# EAGLE design RFM69_RPI_adapter (EAGLE 8.5.1)
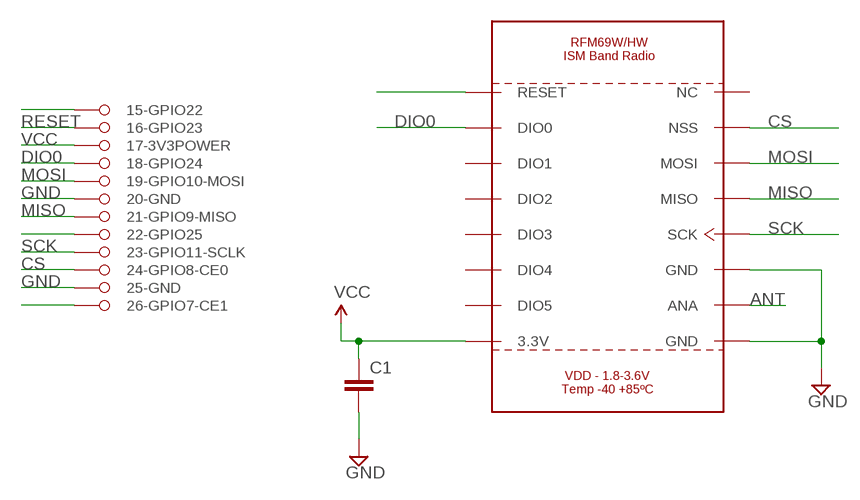
[diagram p0: schematic, sheet 1]

## Parts
C1  C-EUC1206K  [C1206K]
U$1  RFM69W/HW-  [RFM69W/HW]
U$2  RASPBPI_16-26  [RASPBP1_16-26]

## Nets
ANT: U$1.P$10(ANA)
CS: U$1.P$15(NSS) U$2.24-GPIO8-CE0
DIO0: U$1.P$2(DIO0) U$2.18-GPIO24
GND: C1.2 U$1.P$9(GND) U$1.P$11(GND) U$2.20-GND U$2.25-GND
MISO: U$1.P$13(MISO) U$2.21-GPIO9-MISO
MOSI: U$1.P$14(MOSI) U$2.19-GPIO10-MOSI
N$1: U$2.26.GPIO6-CE1(26-GPIO7-CE1)
N$5: U$2.22-GPIO25
N$12: U$2.15-GPIO22
RESET: U$1.P$1(RESET) U$2.16-GPIO23
SCK: U$1.P$12(SCK) U$2.23-GPIO11-SCKL(23-GPIO11-SCLK)
VCC: C1.1 U$1.P$8(3.3V) U$2.17-3V3POWER
Unconnected: U$1.P$3(DIO1) U$1.P$4(DIO2) U$1.P$5(DIO3) U$1.P$6(DIO4) U$1.P$7(DIO5) U$1.P$16(NC)

## Library data of the parts
C1 = rcl:C-EU: CAPACITOR, European symbol; SPICEPREFIX: C
U$1 = HopeRF:RFM69W/HW: HopeRF RFM69W / RFM69HW ISM Band Radio Modules The RFM69W/HW are transceiver modules capable of operation over a wide frequency range, including the 315, 433, 868 and 915MHz license-free ISM (Industry Scientific and Medical) frequency bands. All major RF communication parameters are programmable and most of them can be dynamically set. The RFM69W/HW offer the unique advantage of programmable narrow-band and wide- band communication modes The RFM69W/HW are optimized for low power consumption while offering high RF output power and channelized operation. Compliance ETSI and FCC regulations. Features +13 dBm (+20 dBm - 100 mW for HW variant) Power Output Capability High Sensitivity: down to -120 dBm at 1.2 kbps High Selectivity: 16-tap FIR Channel Filter Bullet-proof front end: IIP3 = -18 dBm, IIP2 = +35 dBm,80 dB Blocking Immunity, no Image Frequency response Low current: Rx = 16 mA, 100nA register retention Programmable Pout: -18 to +13 dBm (+20 dBm for the HW variant) in 1dB steps Constant RF performance over voltage range of module FSK Bit rates up to 300 kb/s Fully integrated synthesizer with a resolution of 61 Hz FSK, GFSK, MSK, GMSK and OOK modulations Built-in Bit Synchronizer performing Clock Recovery Incoming Sync Word Recognition 115 dB+ Dynamic Range RSSI Automatic RF Sense with ultra-fast AFC Packet engine with CRC-16, AES-128, 66-byte FIFO Built-in temperature sensor Module Size:19.7X16mm Purchase at: Anarduino.com <http://www.anarduino.com/?cid=1> RS Components <http://au.rs-online.com/web/c/computing-peripherals/wireless-components-modules/telemetry-modules/?searchTerm=RFM69W&h=s&sra=oss&redirect-relevancy-data=636F3D3226696E3D4931384E4B6E6F776E41734D504E266C753D656E266D6D3D6D61746368616C6C7061727469616C26706D3D5E5B5C707B4C7D5C707B4E647D2D2C2F255C2E5D2B2426706F3D313326736E3D592673743D4D414E5F504152545F4E554D4245522677633D424F5448267573743D52464D363957267374613D52464D36395726>
U$2 = My_library:RASPBPI_16-26

## Net classes
1 power: width 0.203 mm, drill 0.305 mm, clearance 0.152 mm

## Board
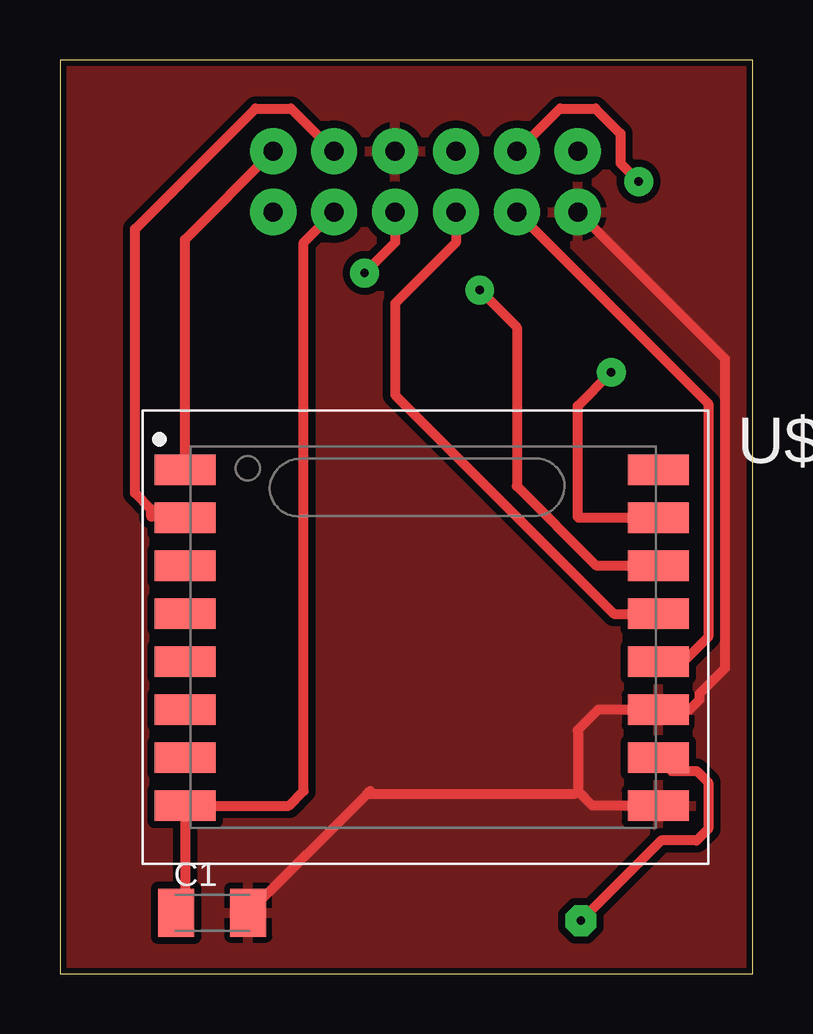
[diagram p1: board, top side]
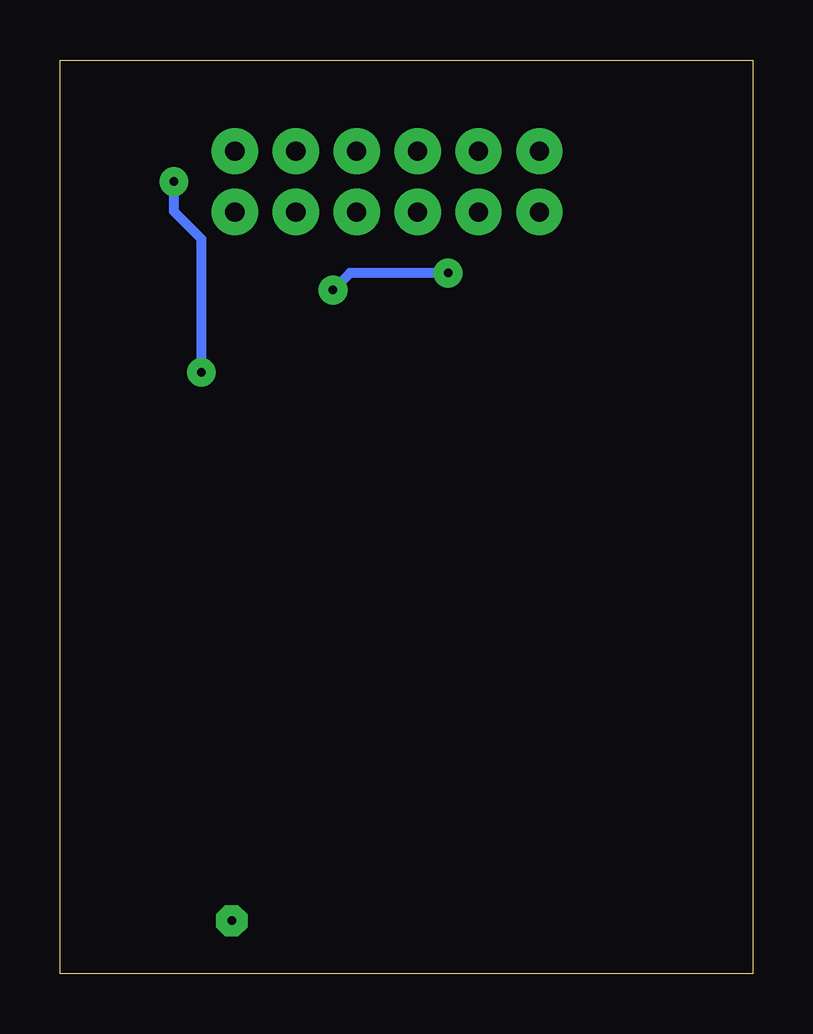
[diagram p2: board, bottom side, seen from below]

Size 28.88 x 38.09 mm. Coordinates in mm from the lower left corner, seen from the top.
Outline: 0,0 28.88,0 28.88,38.09 0,38.09 0,0
Copper layers (1*16): Top 0.035mm / dielectric 1.5mm / Bottom 0.035mm
Design rules "default *": minimum track width 6mil, minimum drill 0.35mm, track to track 12mil, track to pad 50mil, pad to pad 12mil, via to via 12mil, smd to smd 6mil, copper to edge 10mil, drill to drill 6mil, minimum pad ring 10mil, minimum via ring 8mil, stop-mask expansion 4mil, vias tented up to drill 0mil, thermal gap 10mil

### Footprints (pad centres in the part's own frame; a part is rotated, then mirrored left to right if it is on the bottom)
C1206K = smd 1.5 x 2: 1 -1.5,0; 2 1.5,0
RFM69W/HW = smd 2.54 x 1.27: P$1 -10.03,7.035; P$2 -10.03,5.035; P$3 -10.03,3.035; P$4 -10.03,1.035; P$5 -10.03,-0.965; P$6 -10.03,-2.965; P$7 -10.03,-4.965; P$8 -10.03,-6.965; P$9 9.7,-6.965; P$10 9.7,-4.965; P$11 9.7,-2.965; P$12 9.7,-0.965; P$13 9.7,1.035; P$14 9.7,3.035; P$15 9.7,5.035; P$16 9.7,7.035
RASPBP1_16-26 = drill 0.8 pad 1.93: 15-GPIO22 0,8.89; 16-GPIO23 2.54,8.89; 17-3V3POWER 0,6.35; 18-GPIO24 2.54,6.35; 19-GPIO10-MOSI 0,3.81; 20-GND 2.54,3.81; 21-GPIO9-MISO 0,1.27; 22-GPIO25 2.54,1.27; 23-GPIO11-SCKL 0,-1.27; 24-GPIO8-CE0 2.54,-1.27; 25-GND 0,-3.81; 26.GPIO6-CE1 2.54,-3.81

### Placement (x,y rotation side)
C1  6.35,2.54 0 top
U$1  15.24,13.97 0 top
U$2  17.78,31.75 90 top

### Tracks (layer width: path | path; a pad name or v marks a point on that pad's centre or on a via)
ANT  (via drill 0.35 pad 1.3)
  Top 0.406: U$1.P$10 25.49,8.45 26.55,8.45 27.02,7.98 27.02,6.03 26.55,5.56 25.06,5.56 v21.72,2.21
CS  (via drill 0.35 pad 1.2)
  Top 0.406: v24.13,33.02 23.37,33.78 23.37,35.03 22.33,36.07 20.85,36.07 19.08,34.29 U$2.24-GPIO8-CE0 | U$1.P$15 21.64,19 21.59,19.05 21.59,23.67 v22.99,25.07
  Bottom 0.406: v22.99,25.07 22.99,30.63 24.13,31.78 v24.13,33.02
DIO0
  Top 0.406: U$1.P$2 5.16,19.05 3.81,19.05 3.81,19.35 3.13,20.03 3.13,31.04 8.15,36.07 9.63,36.07 11.4,34.29 U$2.18-GPIO24
GND
  Top 0.406: U$2.25-GND 21.59,31.78 27.73,25.63 27.73,12.75 26.67,11.68 26.67,11.43 26.25,11 U$1.P$11 | U$1.P$11 23.71,11 | C1.2 12.82,7.51 | 12.82,7.51 12.93,7.62 | U$1.P$9 22.21,7.01 21.59,7.62 | U$1.P$11 22.43,11 21.59,10.16 21.59,7.62 | 12.82,7.51 21.48,7.51 21.59,7.62
  pour Top: 0,38.1 0,0 29.21,0 29.21,38.1
MISO
  Top 0.406: U$2.21-GPIO9-MISO 16.51,30.48 13.97,27.94 13.97,24.13 23.1,15 U$1.P$13
MOSI  (via drill 0.35 pad 1.2)
  Top 0.152: 23.9,17.02 24.13,17.02 24.82,17.02 U$1.P$14
  Top 0.406: v17.5,28.5 19.05,26.95 19.05,20.32 22.35,17.02 24.13,17.02 | U$2.19-GPIO10-MOSI 13.97,30.48 v12.7,29.21
  Bottom 0.406: v17.5,28.5 16.79,29.21 v12.7,29.21
RESET
  Top 0.406: U$1.P$1 5.21,30.61 U$2.16-GPIO23
SCK
  Top 0.406: U$2.23-GPIO11-SCKL 27.02,23.78 27.02,14.03 25.69,12.7 25.25,12.7 U$1.P$12
VCC
  Top 0.406: C1.1 5.21,2.9 U$1.P$8 9.54,7.01 10.16,7.62 10.16,30.48 U$2.17-3V3POWER